# EAGLE design AdaptorEthernet485 (EAGLE 6.5.0)
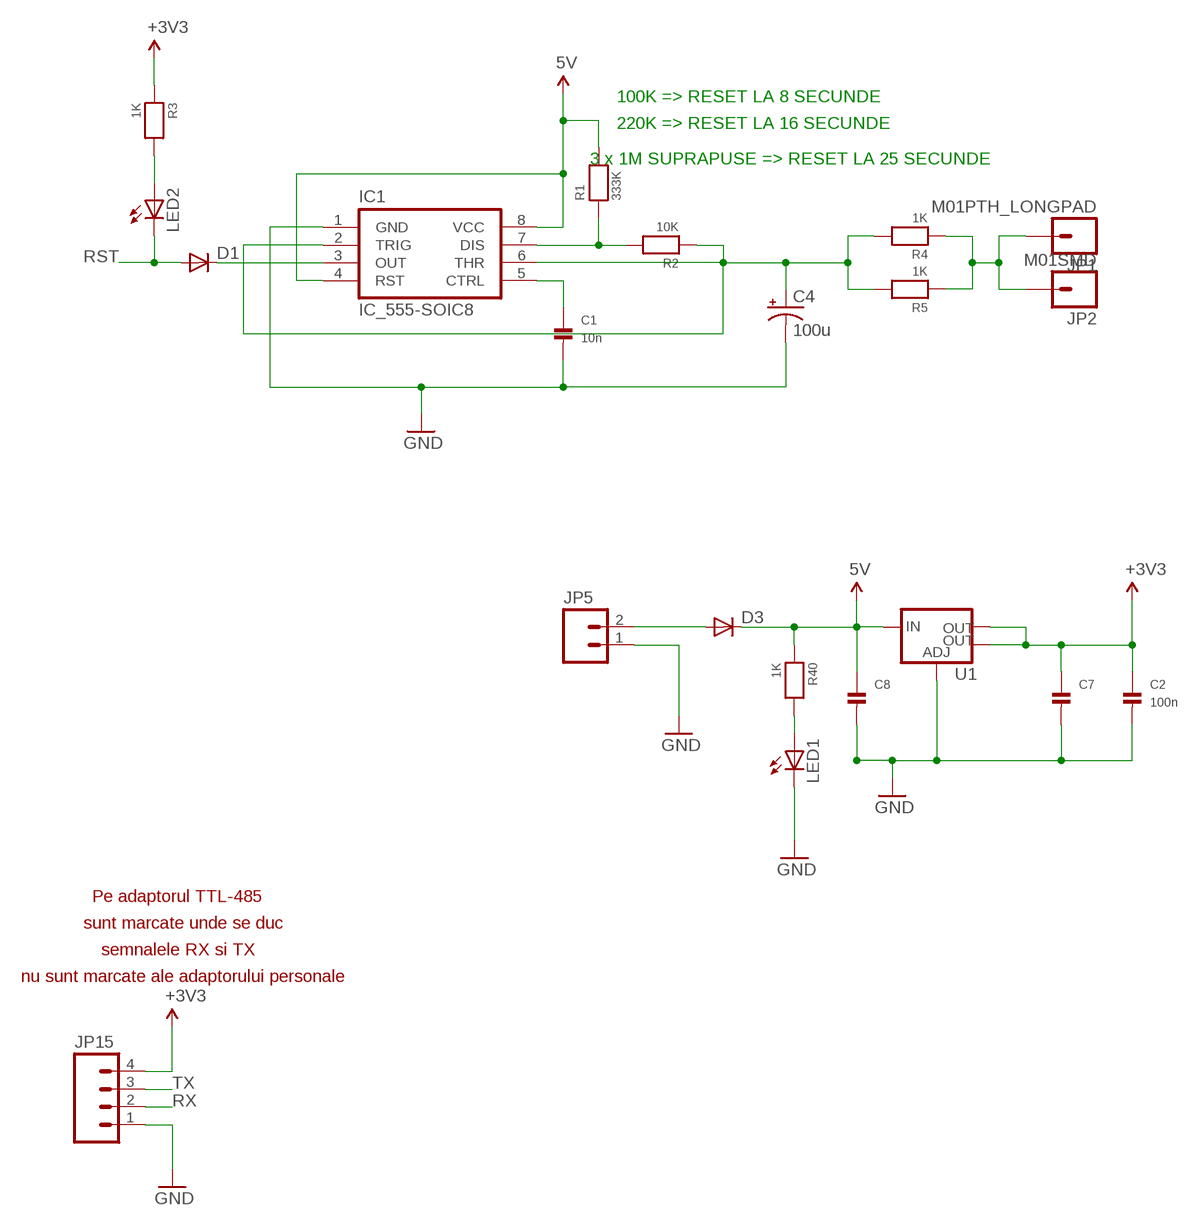
[diagram p0: schematic, sheet 1]

## Parts
C1  10n  CAP_CERAMIC_0805MP  [_0805MP]
C2  100n  CAP_CERAMIC_0805MP  [_0805MP]
C4  100u  CAP_POLPTH2  [CPOL-RADIAL-10UF-25V]
C7  CAP_CERAMIC1206  [1206]
C8  CAP_CERAMIC1206  [1206]
D1  DIODE-DO214AA  [DO214AA]
D3  DIODE-DO214AA  [DO214AA]
IC1  IC_555-SOIC8  [SOIC-8]
JP1  M01PTH_LONGPAD  [1X01_LONGPAD]
JP2  M01SMD  [LUXEON-PAD]
JP5  M02PTH4  [1X02_XTRA_BIG]
JP15  M04LONGPADS  [1X04_LONGPADS]
LED1  LED-3MM-NO_SILK  [LED3MM-NS]
LED2  LED-3MM-NO_SILK  [LED3MM-NS]
R1  333K  RESISTOR_0805MP  [_0805MP]
R2  10K  RESISTOR_0805MP  [_0805MP]
R3  1K  RESISTOR_0805MP  [_0805MP]
R4  1K  RESISTOR_0805MP  [_0805MP]
R5  1K  RESISTOR_0805MP  [_0805MP]
R40  1K  RESISTOR_0805MP  [_0805MP]
U1  V_REG_LM1117SOT223  [SOT223]

## Nets
5V: C8.1 D3.C IC1.4(RST) IC1.8(VCC) R1.2 R40.1 U1.3(IN)
CTRL: C1.1 IC1.5(CTRL)
GND: C1.2 C2.2 C4.2(-) C7.2 C8.2 IC1.1(GND) JP5.1 JP15.1 LED1.K(C) U1.1(ADJ)
N$1: D3.A JP5.2
N$5: LED2.A R3.2
N$6: C4.1(+) IC1.2(TRIG) IC1.6(THR) R2.1 R4.2 R5.2
N$7: D1.C IC1.3(OUT)
N$8: IC1.7(DIS) R1.1 R2.2
N$10: JP1.1 JP2.P$1 R4.1 R5.1
N$45: LED1.A R40.2
RST: D1.A LED2.K(C)
RX: JP15.2
TX: JP15.3
VCC: C2.1 C7.1 JP15.4 R3.1 U1.2(OUT) U1.4(OUT) ; supply symbol labelled +3V3

## Notes on the sheet
- 100K => RESET LA 8 SECUNDE
- 220K => RESET LA 16 SECUNDE
- 3 x 1M SUPRAPUSE => RESET LA 25 SECUNDE
- Pe adaptorul TTL-485
- sunt marcate unde se duc
- semnalele RX si TX
- nu sunt marcate ale adaptorului personale

## Library data of the parts
C1 C2 C7 C8 = microbuilder:CAP_CERAMIC: Ceramic Capacitors 0402 - 0402 Surface Mount Capacitors 16pF 50V 5% [Digikey: 445-4899-2-ND] 18pF 50V 5% [Digikey: 490-1281-2-ND] 22pF 50V 5% [Digikey: 490-1283-2-ND] 68pF 50V 5% [Digikey: 490-1289-2-ND] 0.1uF 10V 10% [Digikey: 490-1318-2-ND] 1.0uF 6.3V 10% [Digikey: 490-1320-2-ND] 0603 - 0603 Surface Mount Capacitors 16 pF 50V 5% [Digikey: 445-5051-2-ND] 22 pF 50V [Digikey: PCC220ACVTR-ND] 33 pF 50V 5% [Digikey: 490-1415-1-ND] 56pF 50V 5% [Digikey: 490-1421-1-ND] 220pF 50V 5% [Digikey: 445-1285-1-ND] 680 pF 50V 2200 pF 50V 5% C0G [Digikey: 445-1297-1-ND] 5600 pF 100V 5% X7R [Digikey: 478-3711-1-ND] 0.1 µF 25V 10% [Digikey: PCC2277TR-ND] 0.22 µF 16V 10% X7R [Digikey: 445-1318-1-ND] 1.0 µF 25V 10% [Digikey: 445-5146-2-ND] 0603 - RF Specific 3pF 250V +/-0.1pF RF [Digikey: 712-1347-1-ND] 18 pF 250V 5% [Digikey: 478-3505-1-ND or 712-1322-1-ND] 56 pF 250V 5% C0G RF [Digikey: 490-4867-1-ND] 68 pF 250V RF [Digikey: 490-4868-1-ND] 0805 - 0805 Surface Mount Capacitors 220 pF 250V 2% RF Ceramic Capacitor [Digikey: 712-1398-1-ND] 1000 pF 50V 2% NP0 Ceramic Capacitor [Digikey: 478-3760-1-ND] 0.1 µF 25V 10% Ceramic Capacitor [Digikey: PCC1828TR-ND] 1.0 µF 16V 10% Ceramic Capacitor[Digikey: 490-1691-2-ND] 10.0 µF 10V 10% Ceramic Capacitor[Digikey: 709-1228-1-ND] 10.0 uF 16V 10% Ceramic Capacitor [Digikey: 478-5165-2-ND] 47 uF 6.3V 20% Ceramic Capacitor [Digikey: 587-1779-1-ND or 399-5506-1-ND] 1206 - 1206 Surface Mount Capacitors 47uF 10V 20% Ceramic Capacitor [Digikey: 490-5528-1-ND or 399-5508-1-ND or 445-6010-1-ND] 100uF 6.3V -20%, +80% Y5V Ceramic Capacitor (Digikey: 490-4512-1-ND, Mouser: 81-GRM31CF50J107ZE1L)
C4 = SparkFun-Passives:CAP_POL: Capacitor Polarized These are standard SMD and PTH capacitors. Normally 10uF, 47uF, and 100uF in electrolytic and tantalum varieties. Always verify the external diameter of the through hole cap, it varies with capacity, voltage, and manufacturer. The EIA devices should be standard.
D1 D3 = diode:DIODE-: DIODE
IC1 = dp_devices:IC_555: Classic 555 IC
JP1 JP2 = SparkFun-Connectors:M01: Header 1 Standard 1-pin 0.1" header. Use with straight break away headers (SKU : PRT-00116), right angle break away headers (PRT-00553), swiss pins (PRT-00743), machine pins (PRT-00117), and female headers (PRT-00115).
JP5 = SparkFun-Connectors:M02: Header 2 Standard 2-pin 0.1" header. Use with straight break away headers (SKU : PRT-00116), right angle break away headers (PRT-00553), swiss pins (PRT-00743), machine pins (PRT-00117), and female headers (PRT-00115). Molex polarized connector foot print use with SKU : PRT-08233 with associated crimp pins and housings.
JP15 = SparkFun-Connectors:M04: Header 4 Standard 4-pin 0.1" header. Use with straight break away headers (SKU : PRT-00116), right angle break away headers (PRT-00553), swiss pins (PRT-00743), machine pins (PRT-00117), and female headers (PRT-00115). Molex polarized connector foot print use with SKU : PRT-08231 with associated crimp pins and housings. 1MM SMD Version SKU: PRT-10208
LED1 LED2 = SparkFun-LED:LED: LEDs Standard schematic elements and footprints for 5mm, 3mm, 1206, and 0603 sized LEDs. 5mm - Spark Fun Electronics SKU : COM-00529 (and others)
R1-R5 R40 = microbuilder:RESISTOR: Resistors 0402 - 0402 Surface Mount Package 22 Ohm 1% 1/16W [Digikey: 311-22.0LRTR-ND] 33 Ohm 5% 1/16W 1.0K 5% 1/16W 1.5K 5% 1/16W 2.0K 1% 1/16W 10.0K 1% 1/16W [Digikey: 311-10.0KLRTR-ND] 10.0K 5% 1/16W [Digikey: RMCF0402JT10K0TR-ND] 12.1K 1% 1/16W [Digikey: 311-22.0LRTR-ND] 100.0K 5% 1/16W 0603 - 0603 Surface Mount Package 0 Ohm 1/10 Watt 1% Resistor 15 Ohm 1/10 Watt 1% Resistor 33 Ohm 1/10 Watt 1% Resistor 49.9 Ohm 1/10 Watt 1% Resistor 100 Ohm 1/10 Watt 1% Resistor 150 Ohm 1/10 Watt 1% Resistor 240 Ohm 1/10 Watt 1% Resistor 390 Ohm 1/10 Watt 1% Resistor 560 Ohm 1/10 Watt 1% Resistor 680 Ohm 1/10 Watt 1% Resistor 750 Ohm 1/10 Watt 1% Resistor 1.0K Ohm 1/10 Watt 1% Resistor 1.5K Ohm 1/10 Watt 1% Resistor 2.0K Ohm 1/10 Watt 1% Resistor 2.2K Ohm 1/10 Watt 1% Resistor 3.3K Ohm 1/10 Watt 1% Resistor 4.7K Ohm 1/10 Watt 1% Resistor 10.0K Ohm 1/10 Watt 1% Resistor 12.0K Ohm 1/10 Watt 1% Resistor 12.1K Ohm 1/10 Watt 1% Resistor 20.0K Ohm 1/10 Watt 1% Resistor 33.0K Ohm 1/10 Watt 1% Resistor 100.0K Ohm 1/10 Watt 1% Resistor 0805 - 0805 Surface Mount Package 0 Ohm 1/8 Watt 1% Resistor 33 Ohm 1/8 Watt 1% Resistor 100 Ohm 1/8 Watt 1% Resistor 150 Ohm 1/8 Watt 1% Resistor 200 Ohm 1/8 Watt 1% Resistor 240 Ohm 1/8 Watt 1% Resistor 330 Ohm 1/8 Watt 1% Resistor 390 Ohm 1/8 Watt 1% Resistor 470 Ohm 1/8 Watt 1% Resistor 1.0K Ohm 1/8 Watt 1% Resistor 1.5K Ohm 1/8 Watt 1% Resistor 2.0K Ohm 1/8 Watt 1% Resistor 4.7K Ohm 1/8 Watt 1% Resistor 5.1K Ohm 1/8 Watt 1% Resistor 5.6K Ohm 1/8 Watt 1% Resistor 10.0K Ohm 1/8 Watt 1% Resistor 22.0K Ohm 1/8 Watt 1% Resistor 33.0K Ohm 1/8 Watt 1% Resistor 100K Ohm 1/8 Watt 1% Resistor 1206 - 1206 Surface Mount Package 2012 - 2010 Surface Mount Package 0.11 Ohm 1/2 Watt 1% Resistor - Digikey: RHM.11UCT-ND
U1 = SparkFun-PowerIC:V_REG_LM1117: Voltage Regulator LM1117 Standard adjustable voltage regulator but in SMD form. Spark Fun Electronics SKU : COM-00595; PROD_ID: VREG-08170

## Board
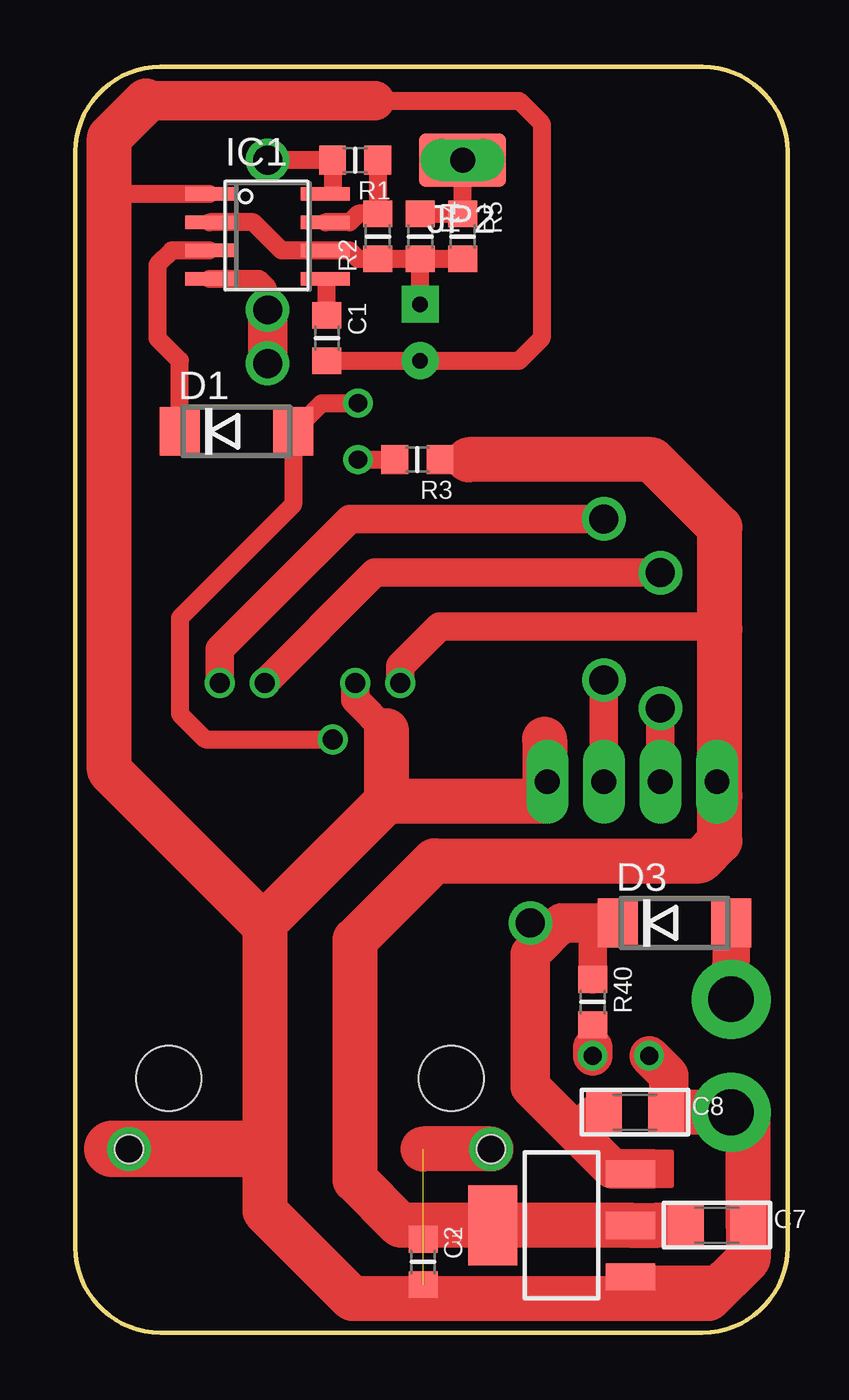
[diagram p1: board, top side]
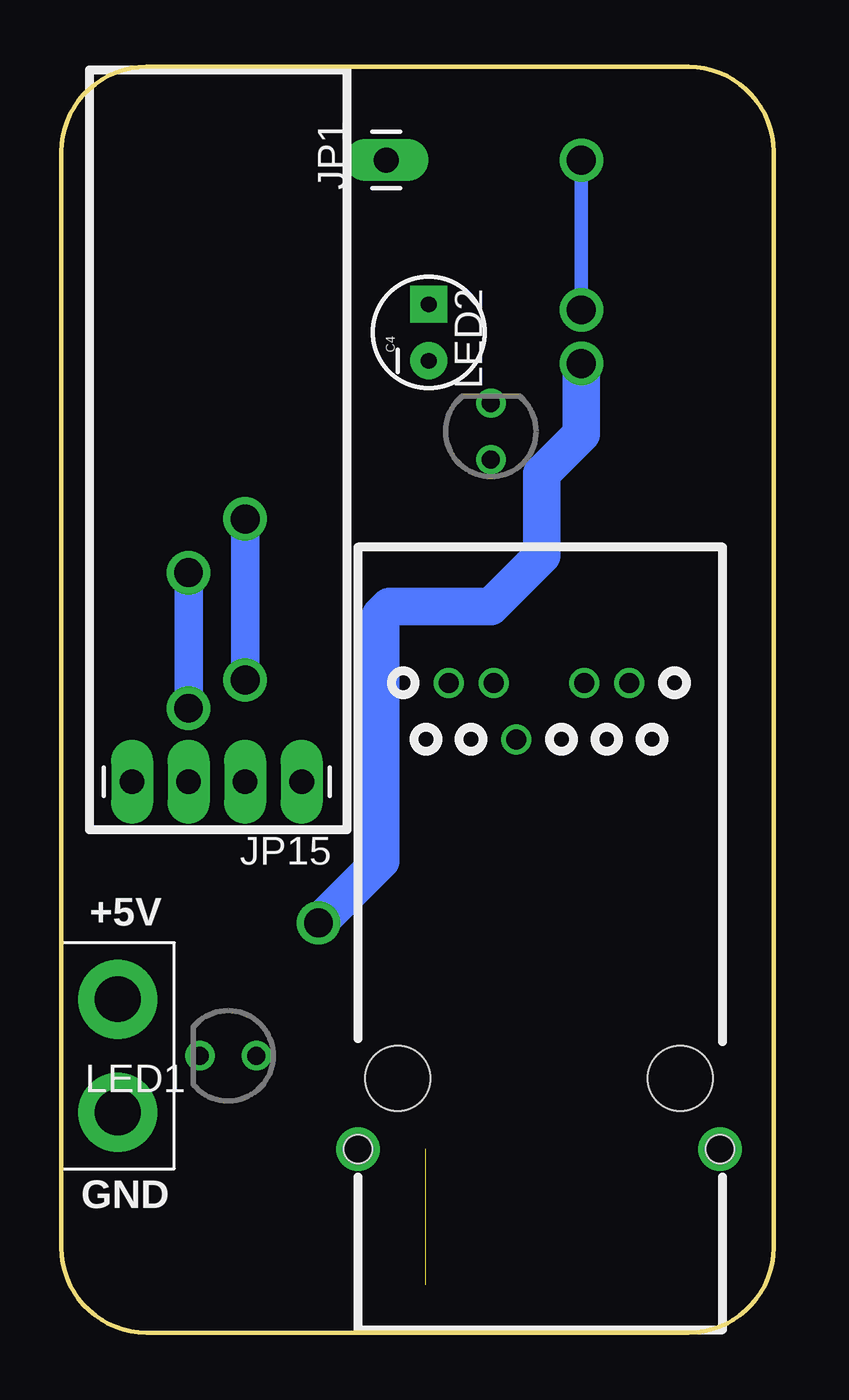
[diagram p2: board, bottom side, seen from below]

Size 32 x 56.9 mm. Coordinates in mm from the lower left corner, seen from the top.
Outline: 32,3.81 32,53.09 arc90 28.19,56.9 3.81,56.9 arc90 0,53.09 0,3.81 arc90 3.81,0 28.19,0 arc90 32,3.81
Copper layers (1*16): Top 0.035mm / dielectric 1.5mm / Bottom 0.035mm
Design rules "default *": minimum track width 10mil, minimum drill 24mil, track to track 8mil, track to pad 8mil, pad to pad 8mil, via to via 8mil, smd to smd 8mil, copper to edge 40mil, drill to drill 8mil, minimum pad ring 10mil, minimum via ring 8mil, stop-mask expansion 4mil, vias tented up to drill 0mil, thermal gap 10mil
Holes 1.27 mm at 2.41,8.26 18.67,8.26
Holes 2.92 mm at 16.89,11.43 4.19,11.43

### Footprints (pad centres in the part's own frame; a part is rotated, then mirrored left to right if it is on the bottom)
_0805MP = smd 1.2 x 1.3: 1 -1.016,0; 2 1.016,0
CPOL-RADIAL-10UF-25V = drill 0.7 pad 1.651 square: 1 1.27,0 | drill 0.7 pad 1.651: 2 -1.27,0
1206 = smd 1.6 x 1.8: 1 -1.4,0; 2 1.4,0
DO214AA = smd 1.8 x 2.2: A 2.55,0; C -2.55,0
SOIC-8 = smd 0.6 x 2.2: 1 -1.905,-2.6; 2 -0.635,-2.6; 3 0.635,-2.6; 4 1.905,-2.6; 5 1.905,2.6; 6 0.635,2.6; 7 -0.635,2.6; 8 -1.905,2.6
1X01_LONGPAD = drill 1.118 pad 1.88 long: 1 0,0
LUXEON-PAD = smd 3.9 x 2.4: P$1 0,0
1X02_XTRA_BIG = drill 2.057 pad 3.556: 1 -2.54,0; 2 2.54,0
1X04_LONGPADS = drill 1.118 pad 1.88 long: 1 0,0; 2 2.54,0; 3 5.08,0; 4 7.62,0
LED3MM-NS = drill 0.813: A -1.27,0; K 1.27,0
SOT223 = smd 1.219 x 2.235: 1 -2.311,-3.099; 2 0,-3.099; 3 2.311,-3.099 | smd 3.6 x 2.2: 4 0,3.099

### Placement (x,y rotation side)
C1  11.3,44.7 270 top
C2  15.62,3.17 270 top
C4  15.49,44.96 90 bottom
C7  28.83,4.83 0 top
C8  25.15,9.91 0 top
D1  7.24,40.51 0 top
D3  26.92,18.41 0 top
IC1  8.64,49.28 270 top
JP1  17.4,52.7 90 bottom
JP2  17.4,52.7 180 top
JP5  29.46,12.45 90 bottom
JP15  21.21,24.77 180 bottom
LED1  24.51,12.45 180 bottom
LED2  12.7,40.51 90 bottom
R1  12.57,52.7 180 top
R2  13.59,49.28 90 top
R3  15.37,39.24 180 top
R4  15.49,49.28 270 top
R5  17.4,49.28 270 top
R40  23.24,14.86 270 top
U1  21.84,4.83 90 top

### Tracks (layer width: path | path; a pad name or v marks a point on that pad's centre or on a via)
5V  (via drill 1.3)
  Top 0.356: C8.1 23.5,9.91 | 11.56,51.31 11.36,51.31 IC1.8
  Top 0.406: U1.3 24.94,7.29 25.02,7.37 | 23.5,9.91 23.37,9.78
  Top 0.813: v8.64,52.7 R1.2 11.56,51.31 | IC1.4 8.26,47.37 8.64,46.99 v8.64,45.97
  Top 1.27: R40.1 23.24,18.41
  Top 1.676: v20.45,18.41 21.08,17.78 21.21,17.78
  Top 1.778: 25.91,7.37 25.02,7.37 24.13,7.37 22.73,8.76 | 22.73,8.76 20.45,11.05 20.45,17.02 21.21,17.78 21.84,18.41 23.24,18.41 D3.C | 23.5,9.91 22.73,9.14 22.73,8.76 | v8.64,45.97 v8.64,43.56
  Bottom 0.61: v8.64,52.7 v8.64,45.97
  Bottom 1.676: v8.64,43.56 8.64,40.39 10.41,38.61 10.41,34.92 12.7,32.64 17.27,32.64 17.65,32.26 17.65,21.21 v20.45,18.41
CTRL
  Top 0.356: 11.3,47.24 11.3,47.3 IC1.5
  Top 0.813: C1.1 11.3,47.24
GND  (via drill 0.9, 1.3)  (1 unrouted)
  Top 0.356: C2.2 15.62,1.65 15.49,1.52 | JP15.1 21.08,26.67 | 26.67,10.54 26.55,10.42 C8.2
  Top 0.406: U1.1 24.77,2.34 24.77,1.52
  Top 0.813: 27.81,9.91 C8.2 | 7.87,8.26 8.26,7.87 8.51,7.87 | IC1.1 1.52,51.18 | C1.2 C4.2 19.94,43.69 20.95,44.7 20.95,54.36 19.94,55.37 13.46,55.37
  Top 1.27: v12.57,29.21 12.57,28.45 13.97,27.05
  Top 1.778: LED1.K 26.67,11.56 26.67,10.54 | 3.17,55.37 13.46,55.37
  Top 2.032: 27.81,9.91 JP5.1 30.23,9.91 C7.2 30.23,3.31 28.45,1.52 24.77,1.52 15.49,1.52 12.45,1.52 8.51,5.46 8.51,7.87 8.51,18.29 | 21.08,26.67 21.08,23.88 13.97,23.88 | 13.97,27.05 13.97,23.88 | 13.97,23.88 8.51,18.41 8.51,18.29 | v18.67,8.26 15.62,8.26 | 8.51,18.29 1.52,25.27 1.52,51.18 1.52,53.72 3.17,55.37
  Top 2.54: 1.65,8.26 v2.41,8.26 7.87,8.26
N$1
  Top 1.676: D3.A 29.45,14.87 JP5.2
N$2
  Top 0.203: 25.78,7.75 26.04,7.75 26.04,8.13 26.8,8.13 26.8,6.6 26.67,6.6 | 25.91,6.6 26.67,6.6 | 26.67,6.6 26.67,6.86 26.54,6.86 26.54,6.73 26.67,6.73 26.67,8 26.54,8
N$3
  Top 0.203: 25.65,1.91 25.91,1.91 25.91,2.92 29.21,2.92 | 29.21,2.92 29.21,3.05 | 29.21,2.92 29.21,2.79 26.04,2.79 26.04,2.67 28.32,2.67 28.32,2.54 26.04,2.54
N$5
  Top 0.813: LED2.A R3.2
N$6
  Top 0.813: R5.2 R4.2 | R4.2 R2.1 12.7,48.26 12.32,48.64 IC1.6 9.27,48.64 8,49.91 IC1.2 | C4.1 R4.2
N$7
  Top 0.813: IC1.3 4.32,48.64 3.68,48.01 3.68,44.7 4.69,43.7 D1.C
N$8
  Top 0.813: R1.1 R2.2 12.7,50.29 12.32,49.91 IC1.7
N$10
  Top 0.813: R4.1 R5.1 JP2.P$1
N$45
  Top 0.356: 23.24,12.83 R40.2
  Top 1.778: LED1.A 23.24,12.83
RST  (via drill 0.9)
  Top 0.813: D1.A 11.06,41.78 LED2.K | D1.A 9.78,37.21 4.7,32.13 4.7,27.81 5.84,26.67 v11.56,26.67
  Top 1.778: D1.A
RX  (via drill 0.9, 1.3)
  Top 1.27: JP15.2 v23.75,29.34 | v23.75,36.58 12.32,36.58 6.48,30.73 v6.48,29.21
  Bottom 1.27: v23.75,29.34 v23.75,36.58
TX  (via drill 0.9, 1.3)
  Top 1.27: JP15.3 v26.29,28.07 | v26.29,34.16 13.46,34.16 v8.51,29.21
  Bottom 1.27: v26.29,28.07 v26.29,34.16
VCC  (via drill 0.9)
  Top 0.356: 26.16,4.83 C7.1 | C2.1 15.62,4.7 15.49,4.83 | JP15.4 28.96,24.64 28.96,24.13
  Top 0.406: 17.65,39.24 R3.1
  Top 1.27: v14.61,29.21 14.61,29.97 16.38,31.75 28.83,31.75 28.96,31.62
  Top 2.032: 26.16,4.83 U1.2 U1.4 15.49,4.83 14.61,4.83 12.57,6.86 12.57,17.65 16.13,21.21 28.07,21.21 28.96,22.1 28.96,24.13 28.96,31.62 28.96,36.2 25.91,39.24 17.65,39.24

### Text on the board
bPlace: +5V | GND